# Altium project FisioV2.PrjPCB
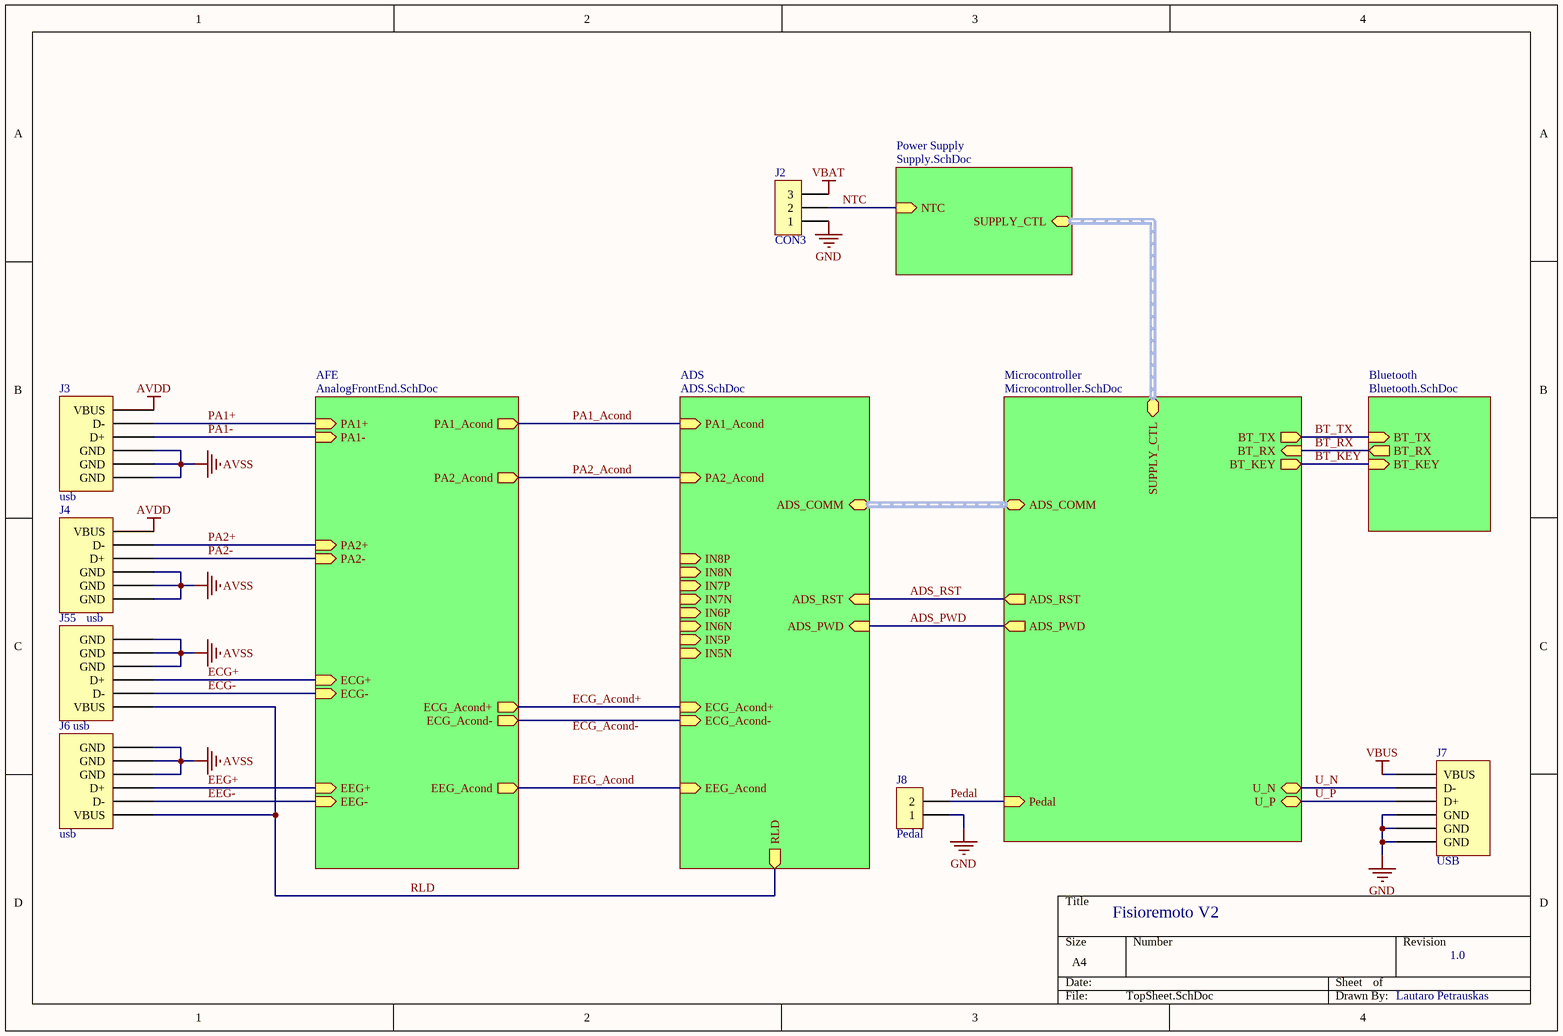
[diagram p0: TopSheet.SchDoc]
8 sheets, 128 parts. Net scope: hierarchical (ports join the sheet entries above them; power ports are global).
Board file: FisioV2.2.PcbDoc
Sheets:
  TopSheet.SchDoc
    Power Supply = Supply.SchDoc
    AFE = AnalogFrontEnd.SchDoc
    ADS = ADS.SchDoc
    Microcontroller = Microcontroller.SchDoc
      Supply = PowerAndClock.SchDoc
      Peripherials = Peripherial.SchDoc
    Bluetooth = Bluetooth.SchDoc

## Sheet TopSheet.SchDoc: Fisioremoto V2
size A4; DrawnBy: Lautaro Petrauskas; Organization: GIBIO; Revision: 1.0

### Parts
(Parts that share a designator on the sheet are numbered #1, #2 ... from top to bottom, then left to right.)
J2  CON3  [SIP3]
J3  usb  [USB_Mini_TipoB]
J4  usb  [USB_Mini_TipoB]
J6#1  usb  [USB_Mini_TipoB]
J7#1  USB  [USB_Micro-B_USB]
J8#1  value Pedal  [SIP2]  (hidden comment: CON2)
J55  usb  [USB_Mini_TipoB]

### Sub-sheets
ADS = ADS.SchDoc: PA1_Acond (in), PA2_Acond (in), ECG_Acond+ (in), ECG_Acond- (in), EEG_Acond (in), RLD (out), ADS_RST (in), ADS_PWD (in), ADS_COMM (harness SPI), IN7P (in), IN6P (in), IN8P (in), IN7N (in), IN8N (in), IN5P (in), IN6N (in), IN5N (in)
AFE = AnalogFrontEnd.SchDoc: PA1+ (in), PA1- (in), PA1_Acond (out), PA2_Acond (out), PA2+ (in), PA2- (in), ECG+ (in), ECG- (in), ECG_Acond+ (out), ECG_Acond- (out), EEG_Acond (out), EEG+ (in), EEG- (in)
Bluetooth = Bluetooth.SchDoc: BT_TX (in), BT_RX (out), BT_KEY (in)
Microcontroller = Microcontroller.SchDoc: ADS_RST (out), ADS_PWD (out), BT_TX (out), BT_RX (in), BT_KEY (out), Pedal (in), ADS_COMM (harness SPI), U_P (bidir), U_N (bidir), SUPPLY_CTL (harness Supply)
Power Supply = Supply.SchDoc: NTC (in), SUPPLY_CTL (harness Supply)

### Nets
AVDD: J3.1(VBUS) J4.1(VBUS)
AVSS: J3.4(GND) J3.5(GND) J3.6(GND) J4.4(GND) J4.5(GND) J4.6(GND) J6#1.4(GND) J6#1.5(GND) J6#1.6(GND) J55.4(GND) J55.5(GND) J55.6(GND)
GND: J2.1 J7#1.4(GND) J7#1.5(GND) J7#1.6(GND) J8#1.1
VBAT: J2.3
VBUS: J7#1.1(VBUS)
ADS_PWD: sheet ADS/ADS_PWD, sheet Microcontroller/ADS_PWD
ADS_RST: sheet ADS/ADS_RST, sheet Microcontroller/ADS_RST
BT_KEY: sheet Microcontroller/BT_KEY, sheet Bluetooth/BT_KEY
BT_RX: sheet Microcontroller/BT_RX, sheet Bluetooth/BT_RX
BT_TX: sheet Microcontroller/BT_TX, sheet Bluetooth/BT_TX
ECG+: J55.3(D+) ; sheet AFE/ECG+
ECG-: J55.2(D-) ; sheet AFE/ECG-
ECG_Acond+: sheet AFE/ECG_Acond+, sheet ADS/ECG_Acond+
EEG+: J6#1.3(D+) ; sheet AFE/EEG+
EEG-: J6#1.2(D-) ; sheet AFE/EEG-
EEG_Acond: sheet AFE/EEG_Acond, sheet ADS/EEG_Acond
NTC: J2.2 ; sheet Power Supply/NTC
PA1+: J3.2(D-) ; sheet AFE/PA1+
PA1-: J3.3(D+) ; sheet AFE/PA1-
PA1_Acond: sheet AFE/PA1_Acond, sheet ADS/PA1_Acond
PA2+: J4.2(D-) ; sheet AFE/PA2+
PA2-: J4.3(D+) ; sheet AFE/PA2-
PA2_Acond: sheet AFE/PA2_Acond, sheet ADS/PA2_Acond
Pedal: J8#1.2 ; sheet Microcontroller/Pedal
RLD: J6#1.1(VBUS) J55.1(VBUS) ; sheet ADS/RLD
U_N: J7#1.2(D-) ; sheet Microcontroller/U_N
U_P: J7#1.3(D+) ; sheet Microcontroller/U_P
NetC22_2: sheet AFE/ECG_Acond-, sheet ADS/ECG_Acond-

### Buses and harness runs
harness sheet ADS/ADS_COMM = sheet Microcontroller/ADS_COMM
harness sheet Microcontroller/SUPPLY_CTL = sheet Power Supply/SUPPLY_CTL

### Notes on the sheet
- Labels drawn without touching a wire or pin: ECG_Acond-

### Library data of the parts
J3 J4 J6#1 J55 = USB_Mini

## Sheet Supply.SchDoc
size A4
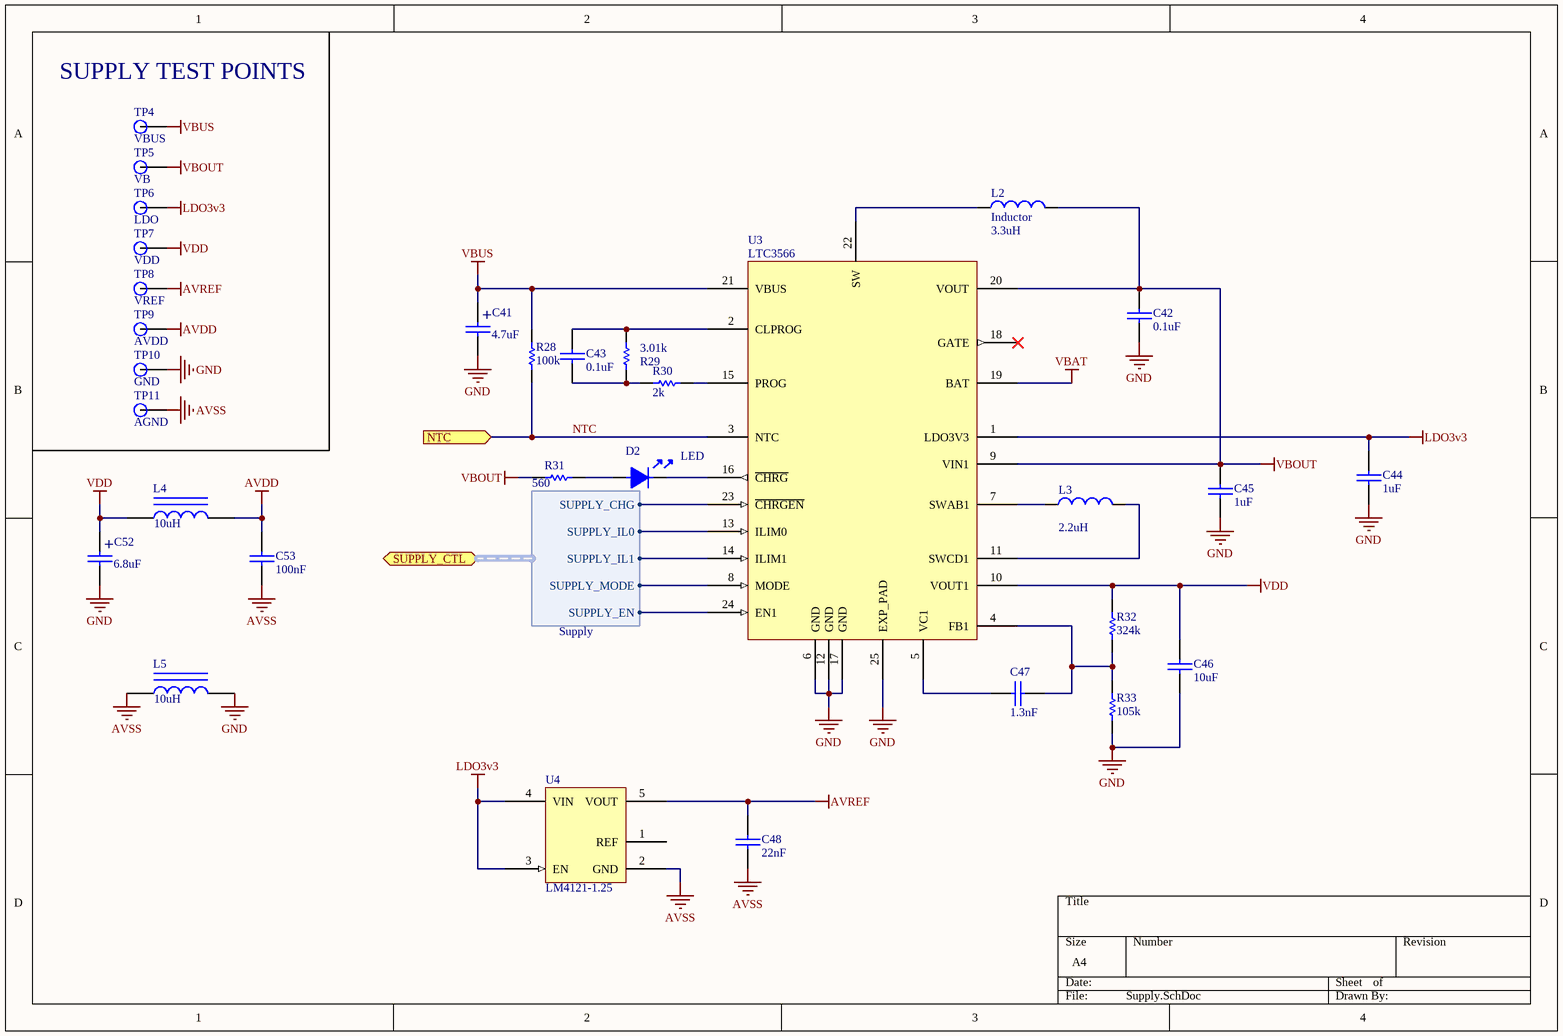
[diagram p1: Supply.SchDoc]

### Parts
C41  value 4.7uF  [1211 (3528)]  (hidden comment: CAPPOL)
C42  value 0.1uF  [0805]  (hidden comment: Capacitor)
C43  value 0.1uF  [0805]  (hidden comment: Capacitor)
C44  value 1uF  [0805]  (hidden comment: Capacitor)
C45  value 1uF  [0805]  (hidden comment: Capacitor)
C46  value 10uF  [0805]  (hidden comment: Capacitor)
C47  value 1.3nF  [0805]  (hidden comment: Capacitor)
C48  value 22nF  [0805]  (hidden comment: Capacitor)
C52  value 6.8uF  [1211 (3528)]  (hidden comment: CAPPOL)
C53  value 100nF  [0805]  (hidden comment: Capacitor)
D2  LED  [LED0805]
L2  Inductor  value 3.3uH  [0805]
L3  value 2.2uH  [0805]  (hidden comment: Inductor)
L4  value 10uH  [1206]  (hidden comment: Inductor Iron)
L5  value 10uH  [1206]  (hidden comment: Inductor Iron)
R28  value 100k  [0805]  (hidden comment: Resistor)
R29  value 3.01k  [0805]  (hidden comment: Resistor)
R30  value 2k  [0805]  (hidden comment: Resistor)
R31  value 560  [0805]  (hidden comment: Resistor)
R32  value 324k  [0805]  (hidden comment: Resistor)
R33  value 105k  [0805]  (hidden comment: Resistor)
TP4  VBUS  [PAD]
TP5  VB  [PAD]
TP6  LDO  [PAD]
TP7  VDD  [PAD]
TP8  VREF  [PAD]
TP9  AVDD  [PAD]
TP10  GND  [PAD]
TP11  AGND  [PAD]
U3  Part: LTC3566  [QFN24]  (hidden comment: Battery Charger)
U4  Part: LM4121-1.25  [SOT23-5]  (hidden comment: Voltage Reference)

### Ports
NTC (in), SUPPLY_CTL (harness Supply)

### Harnesses
Supply: SUPPLY_IL0, SUPPLY_EN, SUPPLY_MODE, SUPPLY_IL1, SUPPLY_CHG

### Nets
AVDD: C53.2 L4.2 TP9.1
AVREF: C48.2 TP8.1 U4.5(VOUT)
AVSS: C48.1 C53.1 L5.1 TP11.1 U4.2(GND)
GND: C41.2 C42.2 C44.1 C45.1 C46.2 C52.2 L5.2 R33.2 TP10.1 U3.6(GND) U3.12(GND) U3.17(GND) U3.25(EXP_PAD)
LDO3v3: C44.2 TP6.1 U3.1(LDO3V3) U4.3(EN) U4.4(VIN)
VBAT: U3.19(BAT)
VBOUT: C42.1 C45.2 L2.2 R31.2 TP5.1 U3.9(VIN1) U3.20(VOUT)
VBUS: C41.1 R28.1 TP4.1 U3.21(VBUS)
VDD: C46.1 C52.1 L4.1 R32.1 TP7.1 U3.10(VOUT1)
NTC: R28.2 U3.3(NTC) ; port NTC
NetC43_1: C43.1 R29.2 U3.2(CLPROG)
NetC43_2: C43.2 R29.1 R30.2
NetC47_1: C47.1 U3.5(VC1)
NetC47_2: C47.2 R32.2 R33.1 U3.4(FB1)
NetD2_1: D2.1 R31.1
NetD2_2: D2.2 U3.16(~{CHRG})
NetL2_1: L2.1 U3.22(SW)
NetL3_1: L3.1 U3.7(SWAB1)
NetL3_2: L3.2 U3.11(SWCD1)
NetR30_1: R30.1 U3.15(PROG)
NetU2_37: U3.24(EN1) ; port SUPPLY_CTL.SUPPLY_EN
NetU2_38: U3.8(MODE) ; port SUPPLY_CTL.SUPPLY_MODE
NetU2_39: U3.14(ILIM1) ; port SUPPLY_CTL.SUPPLY_IL1
NetU2_40: U3.13(ILIM0) ; port SUPPLY_CTL.SUPPLY_IL0
NetU2_43: U3.23(~{CHRGEN}) ; port SUPPLY_CTL.SUPPLY_CHG

Not connected (* = marked no-connect by the designer): U3 18(GATE)*; U4 1(REF)

### Notes on the sheet
- (near TP4) SUPPLY TEST POINTS
- (in symbol CAPPOL) +

### Library data of the parts
C41 = CAPPOL: Voltage Rating: 16v; Dielectric: X5R
C52 = CAPPOL: Voltage Rating: 16v; Dielectric: X7R
L2 L3 = Inductor: Code_IEC: 1005; Published: 8-Jun-2000; LatestRevisionDate: 29-May-2009; LatestRevisionNote: IPC-7351 Footprint Added.; PackageReference: 0402-A; Publisher: Altium Limited; PackageDescription: Chip Inductor; Code_JEITA: 0402
L4 L5 = Inductor Iron: Magnetic-Core Inductor; Published: 24-Mar-1999; LatestRevisionDate: 17-Jul-2002; LatestRevisionNote: Re-released for DXP Platform.; PackageReference: AXIAL-0.9; Publisher: Altium Limited
TP4-TP11 = Test Point
U3 = LT3566
C42-C48 C53 = Capacitor: Dielectric: *; Voltage: *

## Sheet AnalogFrontEnd.SchDoc
size A4
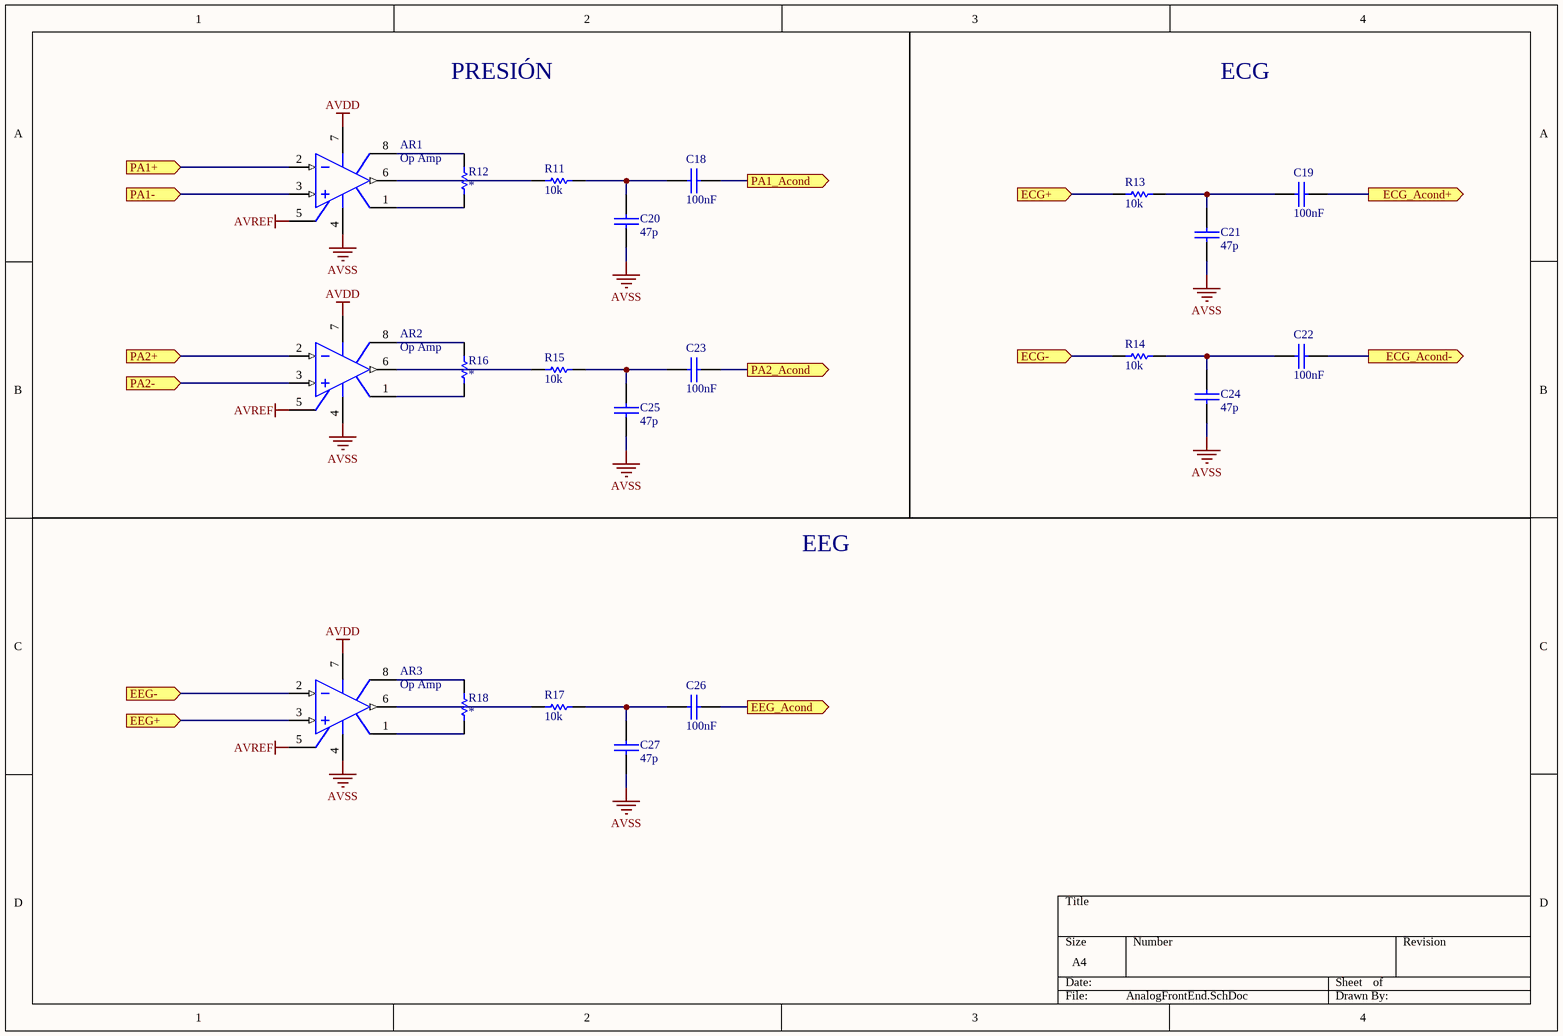
[diagram p2: AnalogFrontEnd.SchDoc]

### Parts
AR1  Op Amp  [SOIC8]
AR2  Op Amp  [SOIC8]
AR3  Op Amp  [SOIC8]
C18  value 100nF  [0805]  (hidden comment: Capacitor)
C19  value 100nF  [0805]  (hidden comment: Capacitor)
C20  value 47p  [0805]  (hidden comment: Capacitor)
C21  value 47p  [0805]  (hidden comment: Capacitor)
C22  value 100nF  [0805]  (hidden comment: Capacitor)
C23  value 100nF  [0805]  (hidden comment: Capacitor)
C24  value 47p  [0805]  (hidden comment: Capacitor)
C25  value 47p  [0805]  (hidden comment: Capacitor)
C26  value 100nF  [0805]  (hidden comment: Capacitor)
C27  value 47p  [0805]  (hidden comment: Capacitor)
R11  value 10k  [0805]  (hidden comment: Resistor)
R12  Resistor  [0805]  (value not drawn)
R13  value 10k  [0805]  (hidden comment: Resistor)
R14  value 10k  [0805]  (hidden comment: Resistor)
R15  value 10k  [0805]  (hidden comment: Resistor)
R16  Resistor  [0805]  (value not drawn)
R17  value 10k  [0805]  (hidden comment: Resistor)
R18  Resistor  [0805]  (value not drawn)

### Ports
ECG+ (in), ECG- (in), ECG_Acond+ (out), ECG_Acond- (out), EEG+ (in), EEG- (in), EEG_Acond (out), PA1+ (in), PA1- (in), PA1_Acond (out), PA2+ (in), PA2- (in), PA2_Acond (out)

### Nets
AVDD: AR1.7(V+) AR2.7(V+) AR3.7(V+)
AVREF: AR1.5(OS_NUL) AR2.5(OS_NUL) AR3.5(OS_NUL)
AVSS: AR1.4(V-) AR2.4(V-) AR3.4(V-) C20.2 C21.2 C24.2 C25.2 C27.2
ECG+: R13.1 ; port ECG+
ECG-: R14.1 ; port ECG-
ECG_Acond+: C19.2 ; port ECG_Acond+
EEG+: AR3.3(IN+) ; port EEG+
EEG-: AR3.2(IN-) ; port EEG-
EEG_Acond: C26.2 ; port EEG_Acond
PA1+: AR1.2(IN-) ; port PA1+
PA1-: AR1.3(IN+) ; port PA1-
PA1_Acond: C18.2 ; port PA1_Acond
PA2+: AR2.2(IN-) ; port PA2+
PA2-: AR2.3(IN+) ; port PA2-
PA2_Acond: C23.2 ; port PA2_Acond
NetAR1_1: AR1.1(OS_NUL) R12.1
NetAR1_6: AR1.6(OUT) R11.1
NetAR1_8: AR1.8(TAB) R12.2
NetAR2_1: AR2.1(OS_NUL) R16.1
NetAR2_6: AR2.6(OUT) R15.1
NetAR2_8: AR2.8(TAB) R16.2
NetAR3_1: AR3.1(OS_NUL) R18.1
NetAR3_6: AR3.6(OUT) R17.1
NetAR3_8: AR3.8(TAB) R18.2
NetC18_1: C18.1 C20.1 R11.2
NetC19_1: C19.1 C21.1 R13.2
NetC22_1: C22.1 C24.1 R14.2
NetC22_2: C22.2 ; port ECG_Acond-
NetC23_1: C23.1 C25.1 R15.2
NetC26_1: C26.1 C27.1 R17.2

### Notes on the sheet
- PRESIÓN
- ECG
- EEG

### Library data of the parts
AR1-AR3 = Op Amp: FET Operational Amplifier; Published: 8-Jun-2000; LatestRevisionDate: 17-Jul-2002; LatestRevisionNote: Re-released for DXP Platform.; DatasheetVersion: REV. B; PackageVersion: 1990; PackageReference: H-08A; Publisher: Altium Limited; PackageDescription: Can; 8 Leads; Pin Circle Dia. 5.08 mm; Lead Dia. 0.53 mm (max); ComponentLink1Description: Manufacturer Link; ComponentLink1URL: http://www.analog.com/
C18-C27 = Capacitor: Dielectric: *; Voltage: *
R11-R18 = Resistor
  R12 R16 R18: Value: *

## Sheet ADS.SchDoc
size A4
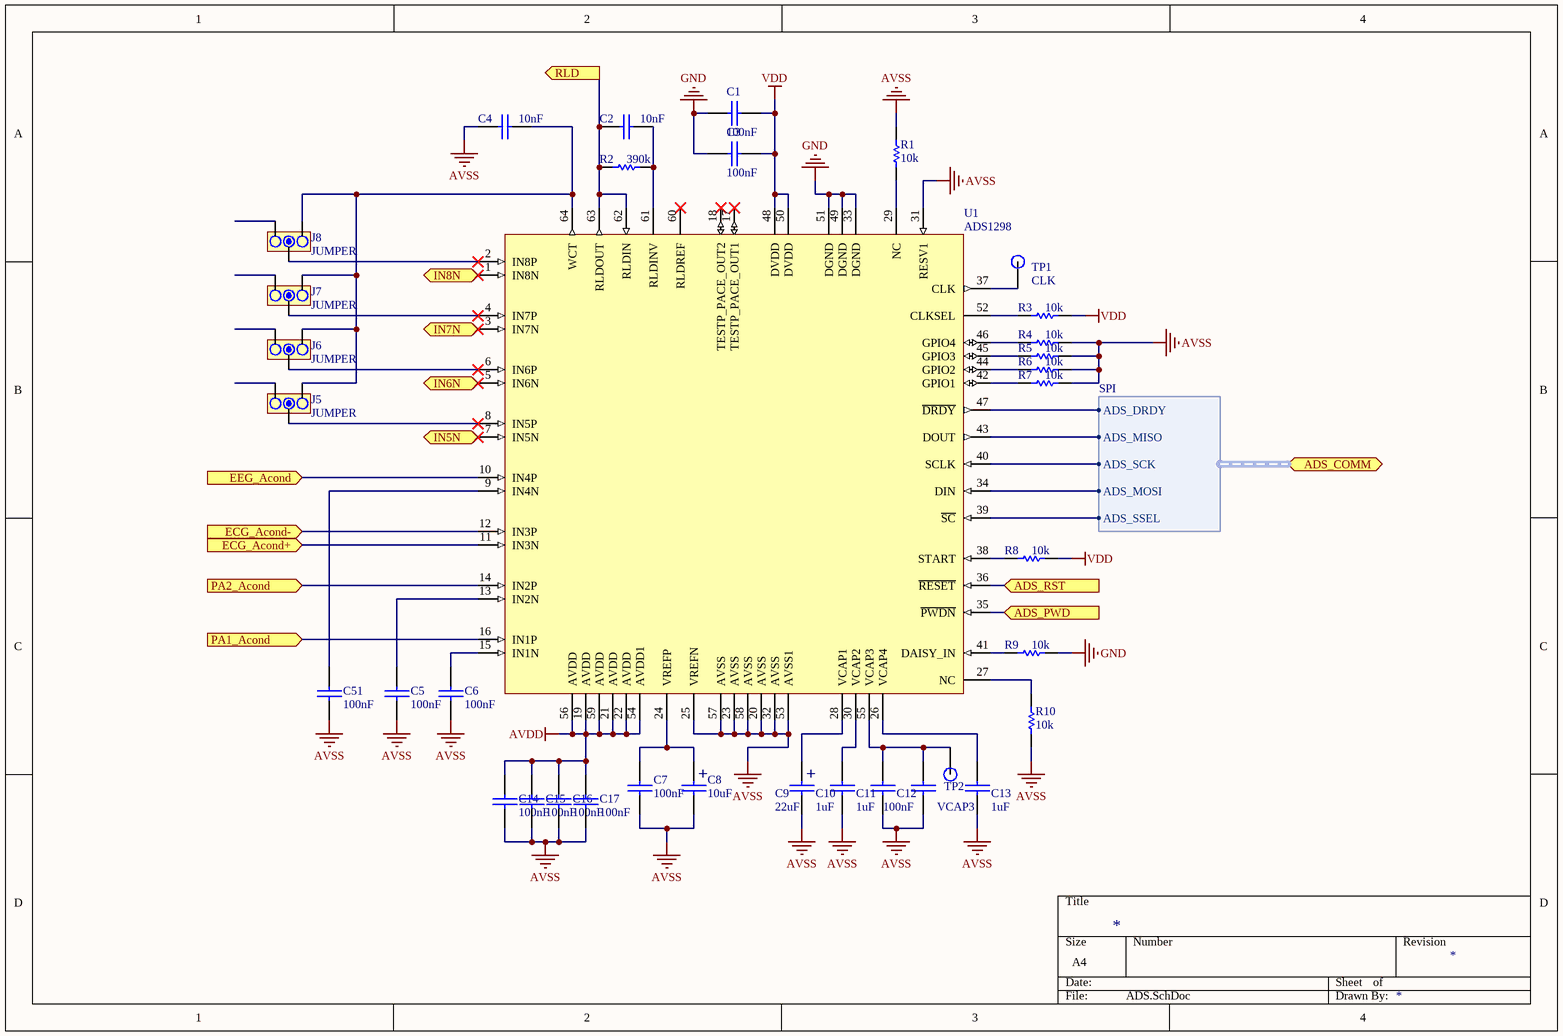
[diagram p3: ADS.SchDoc]

### Parts
(Parts that share a designator on the sheet are numbered #1, #2 ... from top to bottom, then left to right.)
C1  value 100nF  [0805]  (hidden comment: Capacitor)
C2  value 10nF  [0805]  (hidden comment: Capacitor)
C3  value 100nF  [0805]  (hidden comment: Capacitor)
C4  value 10nF  [0805]  (hidden comment: Capacitor)
C5  value 100nF  [0805]  (hidden comment: Capacitor)
C6  value 100nF  [0805]  (hidden comment: Capacitor)
C7  value 100nF  [0805]  (hidden comment: Capacitor)
C8  value 10uF  [1211 (3528)]  (hidden comment: CAPPOL)
C9  value 22uF  [1211 (3528)]  (hidden comment: CAPPOL)
C10  value 1uF  [0805]  (hidden comment: Capacitor)
C11  value 1uF  [0805]  (hidden comment: Capacitor)
C12  value 100nF  [0805]  (hidden comment: Capacitor)
C13  value 1uF  [0805]  (hidden comment: Capacitor)
C14  value 100nF  [0805]  (hidden comment: Capacitor)
C15  value 100nF  [0805]  (hidden comment: Capacitor)
C16  value 100nF  [0805]  (hidden comment: Capacitor)
C17  value 100nF  [0805]  (hidden comment: Capacitor)
C51  value 100nF  [0805]  (hidden comment: Capacitor)
J5  JUMPER  [JUMPER3]
J6#2  JUMPER  [JUMPER3]
J7#2  JUMPER  [JUMPER3]
J8#2  JUMPER  [JUMPER3]
R1  value 10k  [0805]  (hidden comment: Resistor)
R2  value 390k  [0805]  (hidden comment: Resistor)
R3  value 10k  [0805]  (hidden comment: Resistor)
R4  value 10k  [0805]  (hidden comment: Resistor)
R5  value 10k  [0805]  (hidden comment: Resistor)
R6  value 10k  [0805]  (hidden comment: Resistor)
R7  value 10k  [0805]  (hidden comment: Resistor)
R8  value 10k  [0805]  (hidden comment: Resistor)
R9  value 10k  [0805]  (hidden comment: Resistor)
R10  value 10k  [0805]  (hidden comment: Resistor)
TP1  CLK  [PAD]
TP2  VCAP3  [PAD]
U1  ADS1298  [PAG64]

### Ports
ADS_COMM (harness SPI), ADS_PWD (in), ADS_RST (in), ECG_Acond+ (in), ECG_Acond- (in), EEG_Acond (in), IN5N (in), IN6N (in), IN7N (in), IN8N (in), PA1_Acond (in), PA2_Acond (in), RLD (out)

### Harnesses
SPI: ADS_DRDY, ADS_MISO, ADS_SCK, ADS_MOSI, ADS_SSEL

### Nets
AVDD: C14.1 C15.1 C16.1 C17.1 U1.19(AVDD) U1.21(AVDD) U1.22(AVDD) U1.54(AVDD1) U1.56(AVDD) U1.59(AVDD)
AVSS: C4.2 C5.1 C6.1 C7.1 C8.2 C9.2 C10.1 C11.1 C12.1 C13.1 C14.2 C15.2 C16.2 C17.2 C51.1 R1.1 R4.2 R5.2 R6.2 R7.2 R10.1 U1.20(AVSS) U1.23(AVSS) U1.25(VREFN) U1.31(RESV1) U1.32(AVSS) U1.53(AVSS1) U1.57(AVSS) U1.58(AVSS)
GND: C1.2 C3.2 R9.2 U1.33(DGND) U1.49(DGND) U1.51(DGND)
VDD: C1.1 C3.1 R3.2 R8.2 U1.48(DVDD) U1.50(DVDD)
ADS_PWD: U1.35(~{PWDN}) ; port ADS_PWD
ADS_RST: U1.36(~{RESET}) ; port ADS_RST
ECG_Acond+: U1.11(IN3N) ; port ECG_Acond+
EEG_Acond: U1.10(IN4P) ; port EEG_Acond
PA1_Acond: U1.16(IN1P) ; port PA1_Acond
PA2_Acond: U1.14(IN2P) ; port PA2_Acond
RLD: C2.2 R2.1 U1.62(RLDIN) U1.63(RLDOUT) ; port RLD
NetC2_1: C2.1 R2.2 U1.61(RLDINV)
NetC4_1: C4.1 J5.3 J6#2.3 J7#2.3 J8#2.3 U1.64(WCT)
NetC5_2: C5.2 U1.13(IN2N)
NetC6_2: C6.2 U1.15(IN1N)
NetC7_2: C7.2 C8.1 U1.24(VREFP)
NetC9_1: C9.1 U1.28(VCAP1)
NetC10_2: C10.2 U1.30(VCAP2)
NetC11_2: C11.2 C12.2 TP2.1 U1.55(VCAP3)
NetC13_2: C13.2 U1.26(VCAP4)
NetC22_2: U1.12(IN3P) ; port ECG_Acond-
NetC51_2: C51.2 U1.9(IN4N)
NetJ5_2: J5.2 U1.8(IN5P)
NetJ6#2_2: J6#2.2 U1.6(IN6P)
NetJ7#2_2: J7#2.2 U1.4(IN7P)
NetJ8#2_2: J8#2.2 U1.2(IN8P)
NetR1_2: R1.2 U1.29(NC)
NetR3_1: R3.1 U1.52(CLKSEL)
NetR4_1: R4.1 U1.46(GPIO4)
NetR5_1: R5.1 U1.45(GPIO3)
NetR6_1: R6.1 U1.44(GPIO2)
NetR7_1: R7.1 U1.42(GPIO1)
NetR8_1: R8.1 U1.38(START)
NetR9_1: R9.1 U1.41(DAISY_IN)
NetR10_2: R10.2 U1.27(NC)
NetTP1_1: TP1.1 U1.37(CLK)
NetU1_1: U1.1(IN8N) ; port IN8N
NetU1_3: U1.3(IN7N) ; port IN7N
NetU1_5: U1.5(IN6N) ; port IN6N
NetU1_7: U1.7(IN5N) ; port IN5N
NetU1_34: U1.34(DIN) ; port ADS_COMM.ADS_MOSI
NetU1_39: U1.39(~{SC}) ; port ADS_COMM.ADS_SSEL
NetU1_40: U1.40(SCLK) ; port ADS_COMM.ADS_SCK
NetU1_43: U1.43(DOUT) ; port ADS_COMM.ADS_MISO
NetU1_47: U1.47(~{DRDY}) ; port ADS_COMM.ADS_DRDY

Not connected (* = marked no-connect by the designer): J5 1; J6#2 1; J7#2 1; J8#2 1; U1 17(TESTP_PACE_OUT1)* 18(TESTP_PACE_OUT2)* 60(RLDREF)*

### Notes on the sheet
- (in symbol CAPPOL) +

### Library data of the parts
C10-C13 = Capacitor: Dielectric: X5R; Voltage: *
J5 J6#2 J7#2 J8#2 = JUMPER3
TP1 TP2 = Test Point
C1-C7 C14-C17 C51 = Capacitor: Dielectric: *; Voltage: *

## Sheet Microcontroller.SchDoc
size A4
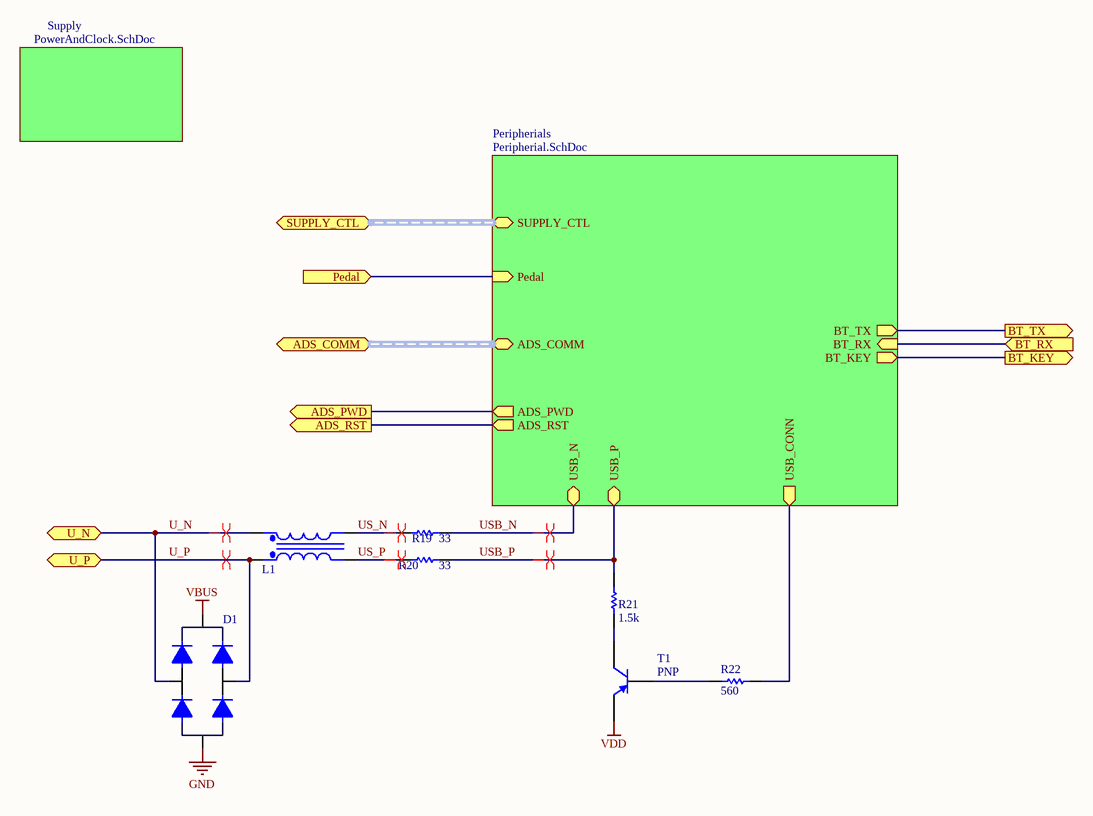
[diagram p4: Microcontroller.SchDoc]

### Parts
D1  ESD Diode  [SOT-143_M]  (value not drawn)
L1  Choke Coil  [1206-4]  (value not drawn)
R19  value 33  [0805]  (hidden comment: Resistor)
R20  value 33  [0805]  (hidden comment: Resistor)
R21  value 1.5k  [0805]  (hidden comment: Resistor)
R22  value 560  [0805]  (hidden comment: Resistor)
T1  PNP  [SOT23]

### Sub-sheets
Peripherials = Peripherial.SchDoc: USB_CONN (out), USB_P (bidir), USB_N (bidir), ADS_RST (out), ADS_PWD (out), BT_TX (out), BT_RX (in), BT_KEY (out), Pedal (in), ADS_COMM (harness SPI), SUPPLY_CTL (harness Supply)
Supply = PowerAndClock.SchDoc: no entries

### Ports
ADS_COMM (harness SPI), ADS_PWD (out), ADS_RST (out), BT_KEY (out), BT_RX (in), BT_TX (out), Pedal (in), SUPPLY_CTL (harness SUPPLY), U_N (bidir), U_P (bidir)

### Nets
GND: D1.1
VBUS: D1.4
VDD: T1.3(E)
ADS_PWD: port ADS_PWD, sheet Peripherials/ADS_PWD
ADS_RST: port ADS_RST, sheet Peripherials/ADS_RST
BT_KEY: port BT_KEY, sheet Peripherials/BT_KEY
BT_RX: port BT_RX, sheet Peripherials/BT_RX
BT_TX: port BT_TX, sheet Peripherials/BT_TX
Pedal: port Pedal, sheet Peripherials/Pedal
U_N: D1.3 L1.4(Sec-) ; port U_N
U_P: D1.2 L1.1(Pri+) ; port U_P
US_N: L1.3(Sec+) R19.1
US_P: L1.2(Pri-) R20.1
USB_N: R19.2 ; sheet Peripherials/USB_N
USB_P: R20.2 R21.2 ; sheet Peripherials/USB_P
NetR21_1: R21.1 T1.1(C)
NetR22_1: R22.1 T1.2(B)
NetR22_2: R22.2 ; sheet Peripherials/USB_CONN

### Buses and harness runs
harness port ADS_COMM = sheet Peripherials/ADS_COMM
harness port SUPPLY_CTL = sheet Peripherials/SUPPLY_CTL

### Layout directives
differential pair: U_N, U_P, US_N, US_P, USB_N, USB_P

### Library data of the parts
D1 = ESD Diode: ESD Protection

## Sheet PowerAndClock.SchDoc
size A4
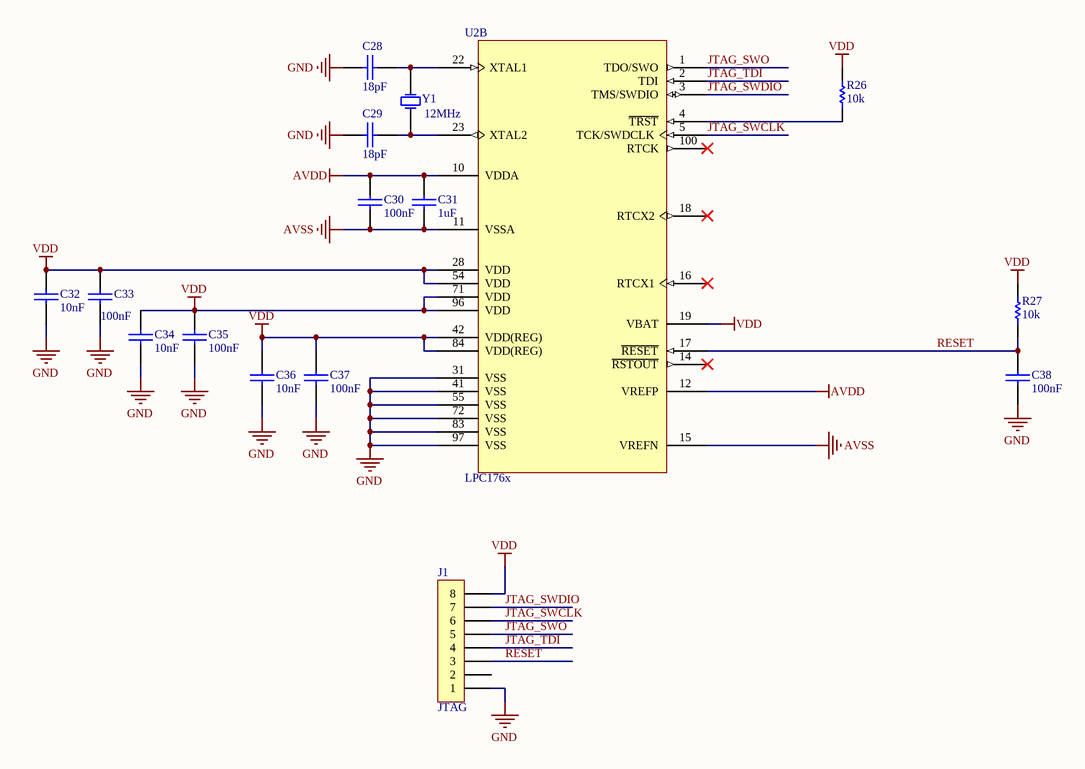
[diagram p5: PowerAndClock.SchDoc]

### Parts
C28  value 18pF  [0805]  (hidden comment: Capacitor)
C29  value 18pF  [0805]  (hidden comment: Capacitor)
C30  value 100nF  [0805]  (hidden comment: Capacitor)
C31  value 1uF  [0805]  (hidden comment: Capacitor)
C32  value 10nF  [0805]  (hidden comment: Capacitor)
C33  value 100nF  [0805]  (hidden comment: Capacitor)
C34  value 10nF  [0805]  (hidden comment: Capacitor)
C35  value 100nF  [0805]  (hidden comment: Capacitor)
C36  value 10nF  [0805]  (hidden comment: Capacitor)
C37  value 100nF  [0805]  (hidden comment: Capacitor)
C38  value 100nF  [0805]  (hidden comment: Capacitor)
J1  JTAG  [SIP8]
R26  value 10k  [0805]  (hidden comment: Resistor)
R27  value 10k  [0805]  (hidden comment: Resistor)
U2  LPC176x  [QFP100]  (part B of 2)
Y1  12MHz  [Cristal SMD]

### Nets
AVDD: C30.1 C31.1 U2.10(VDDA) U2.12(VREFP)
AVSS: C30.2 C31.2 U2.11(VSSA) U2.15(VREFN)
GND: C28.1 C29.1 C32.2 C33.2 C34.2 C35.2 C36.2 C37.2 C38.2 J1.1 U2.31(VSS) U2.41(VSS) U2.55(VSS) U2.72(VSS) U2.83(VSS) U2.97(VSS)
VDD: C32.1 C33.1 C34.1 C35.1 C36.1 C37.1 J1.8 R26.2 R27.2 U2.19(VBAT) U2.28(VDD) U2.42(VDD(REG)) U2.54(VDD) U2.71(VDD) U2.84(VDD(REG)) U2.96(VDD)
JTAG_SWCLK: J1.6 U2.5(TCK/SWDCLK)
JTAG_SWDIO: J1.7 U2.3(TMS/SWDIO)
JTAG_SWO: J1.5 U2.1(TDO/SWO)
JTAG_TDI: J1.4 U2.2(TDI)
RESET: C38.1 J1.3 R27.1 U2.17(~{RESET})
NetC28_2: C28.2 U2.22(XTAL1) Y1.2(OSC2)
NetC29_2: C29.2 U2.23(XTAL2) Y1.1(OSC1)
NetR26_1: R26.1 U2.4(~{TRST})

Not connected (* = marked no-connect by the designer): J1 2; U2 14(~{RSTOUT})* 16(RTCX1)* 18(RTCX2)* 100(RTCK)*

### Library data of the parts
J1 = CON8
U2 = LPC_17x: LPC176x Microcontroller
Y1 = XTAL: Crystal Oscillator; Published: 8-Jun-2000; LatestRevisionDate: 17-Jul-2002; LatestRevisionNote: Re-released for DXP Platform.; PackageReference: R38; Publisher: Altium Limited; PackageDescription: Crystal, Thru-Hole; 2 Leads; Body 3.1 x 8.2 mm (Dia.xH)
C28-C38 = Capacitor: Dielectric: *; Voltage: *

## Sheet Peripherial.SchDoc
size A4
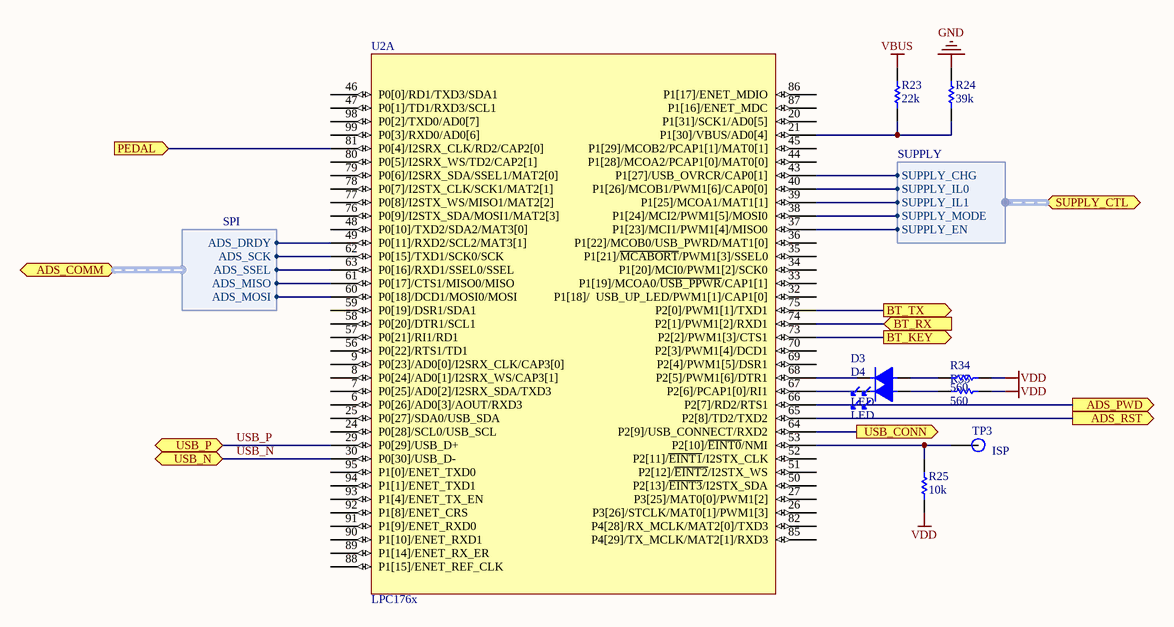
[diagram p6: Peripherial.SchDoc]

### Parts
D3  LED  [LED0805]
D4  LED  [LED0805]
R23  value 22k  [0805]  (hidden comment: Resistor)
R24  value 39k  [0805]  (hidden comment: Resistor)
R25  value 10k  [0805]  (hidden comment: Resistor)
R34  value 560  [0805]  (hidden comment: Resistor)
R35  value 560  [0805]  (hidden comment: Resistor)
TP3  value ISP  [PAD]  (hidden comment: TP)
U2  LPC176x  [QFP100]  (part A of 2)

### Ports
ADS_COMM (harness SPI), ADS_PWD (out), ADS_RST (out), BT_KEY (out), BT_RX (in), BT_TX (out), PEDAL (in), SUPPLY_CTL (harness SUPPLY), USB_CONN (out), USB_N (bidir), USB_P (bidir)

### Harnesses
SPI: ADS_DRDY, ADS_SCK, ADS_SSEL, ADS_MISO, ADS_MOSI
SUPPLY: SUPPLY_CHG, SUPPLY_IL0, SUPPLY_IL1, SUPPLY_MODE, SUPPLY_EN

### Nets
GND: R24.1
VBUS: R23.2
VDD: R25.1 R34.2 R35.2
ADS_PWD: U2.66(P2[7]/RD2/RTS1) ; port ADS_PWD
ADS_RST: U2.65(P2[8]/TD2/TXD2) ; port ADS_RST
BT_KEY: U2.73(P2[2]/PWM1[3]/CTS1) ; port BT_KEY
BT_RX: U2.74(P2[1]/PWM1[2]/RXD1) ; port BT_RX
BT_TX: U2.75(P2[0]/PWM1[1]/TXD1) ; port BT_TX
Pedal: U2.81(P0[4]/I2SRX_CLK/RD2/CAP2[0]) ; port PEDAL
USB_N: U2.30(P0[30]/USB_D-) ; port USB_N
USB_P: U2.29(P0[29]/USB_D+) ; port USB_P
NetD3_1: D3.1 R34.1
NetD3_2: D3.2 U2.68(P2[5]/PWM1[6]/DTR1)
NetD4_1: D4.1 R35.1
NetD4_2: D4.2 U2.67(P2[6]/PCAP1[0]/RI1)
NetR22_2: U2.64(P2[9]/USB_CONNECT/RXD2) ; port USB_CONN
NetR23_1: R23.1 R24.2 U2.21(P1[30]/VBUS/AD0[4])
NetR25_2: R25.2 TP3.1 U2.53(P2[10]/~{EINT0}/NMI)
NetU1_34: U2.60(P0[18]/DCD1/MOSI0/MOSI) ; port ADS_COMM.ADS_MOSI
NetU1_39: U2.63(P0[16]/RXD1/SSEL0/SSEL) ; port ADS_COMM.ADS_SSEL
NetU1_40: U2.62(P0[15]/TXD1/SCK0/SCK) ; port ADS_COMM.ADS_SCK
NetU1_43: U2.61(P0[17]/CTS1/MISO0/MISO) ; port ADS_COMM.ADS_MISO
NetU1_47: U2.49(P0[11]/RXD2/SCL2/MAT3[1]) ; port ADS_COMM.ADS_DRDY
NetU2_37: U2.37(P1[23]/MCI1/PWM1[4]/MISO0) ; port SUPPLY_CTL.SUPPLY_EN
NetU2_38: U2.38(P1[24]/MCI2/PWM1[5]/MOSI0) ; port SUPPLY_CTL.SUPPLY_MODE
NetU2_39: U2.39(P1[25]/MCOA1/MAT1[1]) ; port SUPPLY_CTL.SUPPLY_IL1
NetU2_40: U2.40(P1[26]/MCOB1/PWM1[6]/CAP0[0]) ; port SUPPLY_CTL.SUPPLY_IL0
NetU2_43: U2.43(P1[27]/USB_OVRCR/CAP0[1]) ; port SUPPLY_CTL.SUPPLY_CHG

Not connected (* = marked no-connect by the designer): U2 6(P0[26]/AD0[3]/AOUT/RXD3) 7(P0[25]/AD0[2]/I2SRX_SDA/TXD3) 8(P0[24]/AD0[1]/I2SRX_WS/CAP3[1]) 9(P0[23]/AD0[0]/I2SRX_CLK/CAP3[0]) 20(P1[31]/SCK1/AD0[5]) 24(P0[28]/SCL0/USB_SCL) 25(P0[27]/SDA0/USB_SDA) 26(P3[26]/STCLK/MAT0[1]/PWM1[3]) 27(P3[25]/MAT0[0]/PWM1[2]) 32(P1[18]/__USB_UP_LED/PWM1[1]/CAP1[0]) 33(P1[19]/MCOA0/~{USB_PPWR}/CAP1[1]) 34(P1[20]/MCI0/PWM1[2]/SCK0) 35(P1[21]/~{MCABORT}/PWM1[3]/SSEL0) 36(P1[22]/MCOB0/USB_PWRD/MAT1[0]) 44(P1[28]/MCOA2/PCAP1[0]/MAT0[0]) 45(P1[29]/MCOB2/PCAP1[1]/MAT0[1]) 46(P0[0]/RD1/TXD3/SDA1) 47(P0[1]/TD1/RXD3/SCL1) 48(P0[10]/TXD2/SDA2/MAT3[0]) 50(P2[13]/~{EINT3}/I2STX_SDA) 51(P2[12]/~{EINT2}/I2STX_WS) 52(P2[11]/~{EINT1}/I2STX_CLK) 56(P0[22]/RTS1/TD1) 57(P0[21]/RI1/RD1) 58(P0[20]/DTR1/SCL1) 59(P0[19]/DSR1/SDA1) 69(P2[4]/PWM1[5]/DSR1) 70(P2[3]/PWM1[4]/DCD1) 76(P0[9]/I2STX_SDA/MOSI1/MAT2[3]) 77(P0[8]/I2STX_WS/MISO1/MAT2[2]) 78(P0[7]/I2STX_CLK/SCK1/MAT2[1]) 79(P0[6]/I2SRX_SDA/SSEL1/MAT2[0]) 80(P0[5]/I2SRX_WS/TD2/CAP2[1]) 82(P4[28]/RX_MCLK/MAT2[0]/TXD3) 85(P4[29]/TX_MCLK/MAT2[1]/RXD3) 86(P1[17]/ENET_MDIO) 87(P1[16]/ENET_MDC) 88(P1[15]/ENET_REF_CLK) 89(P1[14]/ENET_RX_ER) 90(P1[10]/ENET_RXD1) 91(P1[9]/ENET_RXD0) 92(P1[8]/ENET_CRS) 93(P1[4]/ENET_TX_EN) 94(P1[1]/ENET_TXD1) 95(P1[0]/ENET_TXD0) 98(P0[2]/TXD0/AD0[7]) 99(P0[3]/RXD0/AD0[6])

### Library data of the parts
TP3 = Test Point
U2 = LPC_17x: LPC176x Microcontroller

## Sheet Bluetooth.SchDoc
size A4
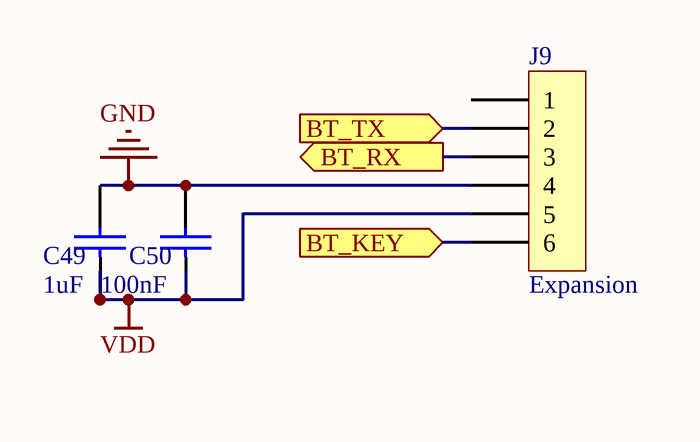
[diagram p7: Bluetooth.SchDoc]

### Parts
C49  value 1uF  [0805]  (hidden comment: Capacitor)
C50  value 100nF  [0805]  (hidden comment: Capacitor)
J9  Expansion  [SIP6]

### Ports
BT_KEY (in), BT_RX (out), BT_TX (in)

### Nets
GND: C49.2 C50.2 J9.4
VDD: C49.1 C50.1 J9.5
BT_KEY: J9.6 ; port BT_KEY
BT_RX: J9.3 ; port BT_RX
BT_TX: J9.2 ; port BT_TX

Not connected (* = marked no-connect by the designer): J9 1

### Library data of the parts
C49 C50 = Capacitor: Dielectric: X5R; Voltage: *
J9 = CON6

## Nets that join several sheets
AVDD: TopSheet (J3.1 J4.1), Supply (C53.2 L4.2 TP9.1), AnalogFrontEnd (AR1.7 AR2.7 AR3.7), ADS (10 pins), PowerAndClock (C30.1 C31.1 U2.10 U2.12)
AVREF: Supply (C48.2 TP8.1 U4.5), AnalogFrontEnd (AR1.5 AR2.5 AR3.5)
AVSS: TopSheet (12 pins), Supply (5 pins), AnalogFrontEnd (8 pins), ADS (29 pins), PowerAndClock (C30.2 C31.2 U2.11 U2.15)
GND: TopSheet (5 pins), Supply (13 pins), ADS (6 pins), Microcontroller (D1.1), PowerAndClock (16 pins), Peripherial (R24.1), Bluetooth (C49.2 C50.2 J9.4)
VBAT: TopSheet (J2.3), Supply (U3.19)
VBUS: TopSheet (J7#1.1), Supply (C41.1 R28.1 TP4.1 U3.21), Microcontroller (D1.4), Peripherial (R23.2)
VDD: Supply (6 pins), ADS (6 pins), Microcontroller (T1.3), PowerAndClock (16 pins), Peripherial (R25.1 R34.2 R35.2), Bluetooth (C49.1 C50.1 J9.5)
ADS_PWD: ADS (U1.35), Peripherial (U2.66)
ADS_RST: ADS (U1.36), Peripherial (U2.65)
BT_KEY: Peripherial (U2.73), Bluetooth (J9.6)
BT_RX: Peripherial (U2.74), Bluetooth (J9.3)
BT_TX: Peripherial (U2.75), Bluetooth (J9.2)
ECG+: TopSheet (J55.3), AnalogFrontEnd (R13.1)
ECG-: TopSheet (J55.2), AnalogFrontEnd (R14.1)
ECG_Acond+: AnalogFrontEnd (C19.2), ADS (U1.11)
EEG+: TopSheet (J6#1.3), AnalogFrontEnd (AR3.3)
EEG-: TopSheet (J6#1.2), AnalogFrontEnd (AR3.2)
EEG_Acond: AnalogFrontEnd (C26.2), ADS (U1.10)
NetC22_2: AnalogFrontEnd (C22.2), ADS (U1.12)
NetR22_2: Microcontroller (R22.2), Peripherial (U2.64)
NetU1_34: ADS (U1.34), Peripherial (U2.60)
NetU1_39: ADS (U1.39), Peripherial (U2.63)
NetU1_40: ADS (U1.40), Peripherial (U2.62)
NetU1_43: ADS (U1.43), Peripherial (U2.61)
NetU1_47: ADS (U1.47), Peripherial (U2.49)
NetU2_37: Supply (U3.24), Peripherial (U2.37)
NetU2_38: Supply (U3.8), Peripherial (U2.38)
NetU2_39: Supply (U3.14), Peripherial (U2.39)
NetU2_40: Supply (U3.13), Peripherial (U2.40)
NetU2_43: Supply (U3.23), Peripherial (U2.43)
NTC: TopSheet (J2.2), Supply (R28.2 U3.3)
PA1+: TopSheet (J3.2), AnalogFrontEnd (AR1.2)
PA1-: TopSheet (J3.3), AnalogFrontEnd (AR1.3)
PA1_Acond: AnalogFrontEnd (C18.2), ADS (U1.16)
PA2+: TopSheet (J4.2), AnalogFrontEnd (AR2.2)
PA2-: TopSheet (J4.3), AnalogFrontEnd (AR2.3)
PA2_Acond: AnalogFrontEnd (C23.2), ADS (U1.14)
Pedal: TopSheet (J8#1.2), Peripherial (U2.81)
RLD: TopSheet (J6#1.1 J55.1), ADS (C2.2 R2.1 U1.62 U1.63)
U_N: TopSheet (J7#1.2), Microcontroller (D1.3 L1.4)
U_P: TopSheet (J7#1.3), Microcontroller (D1.2 L1.1)
USB_N: Microcontroller (R19.2), Peripherial (U2.30)
USB_P: Microcontroller (R20.2 R21.2), Peripherial (U2.29)